# EAGLE design Side 1 v1 (EAGLE 8.5.0)
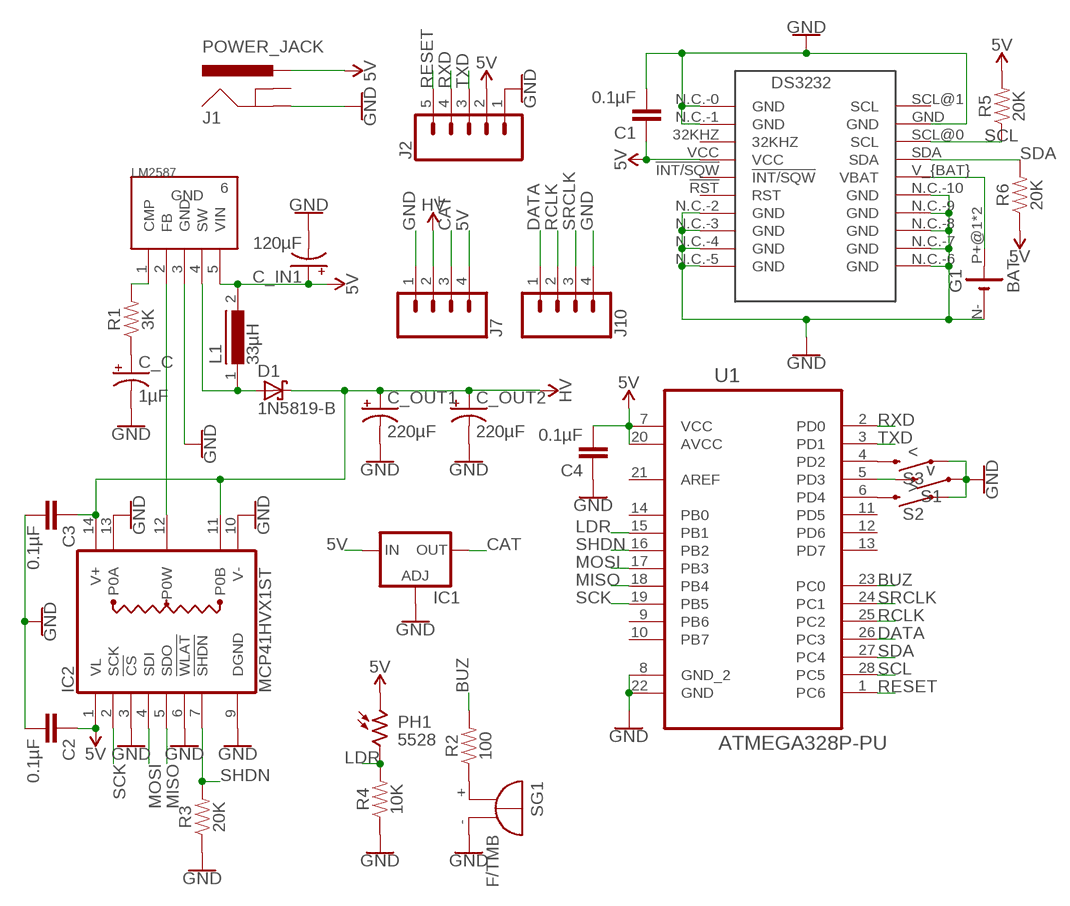
[diagram p0: schematic, sheet 1]

## Parts
C1  0.1µF  0.1µF-0.1''  [CAP-0.1I]
C2  0.1µF  0.1µF-0.1''  [CAP-0.1I]
C3  0.1µF  0.1µF-0.1''  [CAP-0.1I]
C4  0.1µF  0.1µF-0.1''  [CAP-0.1I]
C_C  1µF  CAP_POL_1µF  [CAP_POL_2MM]
C_IN1  120µF  CAP_POL_120µF  [CAP_POL_3MM]
C_OUT1  220µF  1000UF-RADIAL-5MM-25V-20%  [CPOL-RADIAL-5MM-10MM]
C_OUT2  220µF  1000UF-RADIAL-5MM-25V-20%  [CPOL-RADIAL-5MM-10MM]
D1  1N5819-B  [DO41-7.6]
G1  BAT  BATTERY-HOLDER_11.6MM  [CELL_RETAINER_11.6MM]
IC1  LM317TS  [317TS]
IC2  MCP41HVX1ST  [TSSOP14]
J1  POWER_JACK  [POWER_JACK_PTH]
J2  CONN_05  [1X05]
J7  CONN_04  [1X04]
J10  CONN_04  [1X04]
L1  33µH  MICC12  [MICC12]
LM2587  LM2587S  [TO263-5]
PH1  5528  [5528]
R1  3K  RESISTORAXIAL-0.3  [AXIAL-0.3]
R2  100  RESISTORAXIAL-0.3  [AXIAL-0.3]
R3  20K  RESISTORAXIAL-0.3  [AXIAL-0.3]
R4  10K  RESISTORAXIAL-0.3  [AXIAL-0.3]
R5  20K  RESISTORAXIAL-0.3  [AXIAL-0.3]
R6  20K  RESISTORAXIAL-0.3  [AXIAL-0.3]
S1  v  MOMENTARY-SWITCH-SPST-PTH-6.0MM  [TACTILE_SWITCH_PTH_6.0MM]
S2  >  MOMENTARY-SWITCH-SPST-PTH-6.0MM  [TACTILE_SWITCH_PTH_6.0MM]
S3  <  MOMENTARY-SWITCH-SPST-PTH-6.0MM  [TACTILE_SWITCH_PTH_6.0MM]
SG1  F/TMB  [F/TMB]
U1  ATMEGA328P-PU  [DIP254P762X457-28]
U$1  DS3232  [SO20-2]

## Nets
5V: C1.1 C2.1 C4.2 C_IN1.POS(+) IC1.3(IN) IC2.1(VL) J1.PWR J2.2 J7.4 L1.2 LM2587.5(VIN) PH1.1 R5.P$2 R6.P$1 U1.7(VCC) U1.20(AVCC) U$1.VCC
BAT: G1.P+@1(+) G1.P+@2(+) U$1.V_{BAT}(VBAT)
BUZ: R2.P$2 U1.23(PC0)
BUZR: R2.P$1 SG1.+
CAT: IC1.2(OUT) J7.3
DATA: J10.1 U1.26(PC3)
FB: IC2.12(P0W) LM2587.2(FB)
GND: C1.2 C2.2 C3.2 C4.1 C_C.NEG(-) C_IN1.NEG(-) C_OUT1.- C_OUT2.- G1.N-(-) IC1.1(ADJ) IC2.3(!CS) IC2.6(!WLAT) IC2.9(DGND) IC2.10(V-) IC2.13(P0A) J1.GND J2.1 J7.1 J10.4 LM2587.3(GND) R3.P$1 R4.P$1 S1.1 S2.1 S3.1 SG1.- U1.8(GND_2) U1.22(GND) U$1.GND U$1.N.C.-0(GND) U$1.N.C.-1(GND) U$1.N.C.-2(GND) U$1.N.C.-3(GND) U$1.N.C.-4(GND) U$1.N.C.-5(GND) U$1.N.C.-6(GND) U$1.N.C.-7(GND) U$1.N.C.-8(GND) U$1.N.C.-9(GND) U$1.N.C.-10(GND)
LBUT: S3.3 U1.4(PD2)
LDR: PH1.2 R4.P$2 U1.15(PB1)
MBUT: S1.3 U1.5(PD3)
MISO: IC2.5(SDO) U1.18(PB4)
MOSI: IC2.4(SDI) U1.17(PB3)
N$1: D1.A L1.1 LM2587.4(SW)
N$2: LM2587.1(CMP) R1.P$2
N$4: C_C.POS(+) R1.P$1
RBUT: S2.3 U1.6(PD4)
RCLK: J10.2 U1.25(PC2)
RESET: J2.5 U1.1(PC6)
RXD: J2.4 U1.2(PD0)
SCK: IC2.2(SCK) U1.19(PB5)
SCL: R5.P$1 U1.28(PC5) U$1.SCL@0(SCL)
SDA: R6.P$2 U1.27(PC4) U$1.SDA
SHDN: IC2.7(!SHDN) R3.P$2 U1.16(PB2)
SRCLK: J10.3 U1.24(PC1)
TXD: J2.3 U1.3(PD1)
VCC: C3.1 C_OUT1.+ C_OUT2.+ D1.C IC2.11(P0B) IC2.14(V+) J7.2 ; supply symbol labelled HV
Unconnected: J1.GNDBREAK LM2587.6(GND) U1.9(PB6) U1.10(PB7) U1.11(PD5) U1.12(PD6) U1.13(PD7) U1.14(PB0) U1.21(AREF) U$1.32KHZ U$1.!INT/SQW U$1.!RST(RST) U$1.SCL@1(SCL)

## Library data of the parts
C1-C4 = Clock components:0.1µF: 0.1uF/100nF/100,000pF ceramic capacitors A capacitor is a passive two-terminal electrical component used to store electrical energy temporarily in an electric field.
C_C = Clock components:CAP_POL_1µF
C_IN1 = Clock components:CAP_POL_120µF
C_OUT1 C_OUT2 = SparkFun-Capacitors:1000UF: 1,000µF/1mF ceramic capacitors A capacitor is a passive two-terminal electrical component used to store electrical energy temporarily in an electric field. CAP-08070; PROD_ID: CAP-09538; VALUE: 1mF
D1 = diode:1N581*: 1.0A SCHOTTKY BARRIER RECTIFIER Source: http://www.diodes.com/datasheets/ds23001.pdf
G1 = battery:BATTERY-HOLDER_11.6MM: 11.6mm PC BUTTON CELL RETAINER, high 5.97mm KEYSTONE ELECTRONICS CORP. Data sheet <http://www.farnell.com/cad/1718310.pdf>; MF: KEYSTONE; MPN: 2997; OC_FARNELL: 2293265
IC1 = v-reg:LM317TS: VOLTAGE REGULATOR
IC2 = microchip-mcp41hvx1:MCP41HVX1: The MCP45HVX1 family of devices have dual power rails (analog and digital). The analog power rail allows high voltage on the resistor network terminal pins. The analog voltage range is determined by the V+ and V– voltages. The library has been designed by Richard Magdycz <https://www.facebook.com/groups/eaglecadsoftUK>
J1 = SparkFun-Connectors:POWER_JACK: Power Jack Connector This is the standard 5.5mm barrel jack for power. The PTH is the most common, proven, reliable, footprint. The Slot footprint only works if the mill layer is transmitted to the PCB fab house so be warned. Here are the connectors we sell at SparkFun: DC Barrel Power Jack/Connector <https://www.sparkfun.com/products/119> (PRT-00119) DC Barrel Power Jack/Connector (SMD) <https://www.sparkfun.com/products/12748> (PRT-12748) DC Barrel Jack Adapter - Breadboard Compatible <https://www.sparkfun.com/products/10811> (PRT-10811) It is used on this SparkFun product (and many, many others): SparkFun RedBoard - Programmed with Arduino <https://www.sparkfun.com/products/12757> (DEV-12757) Also, if you need a mating power supply or connector, please check these out: Wall Adapter Power Supply - 9VDC 650mA <https://www.sparkfun.com/products/298> (TOL-00298) DC Barrel Jack Adapter - Male <https://www.sparkfun.com/products/10287> (PRT-10287); PROD_ID: CONN-08197
J2 = SparkFun-Connectors:CONN_05: Multi connection point. Often used as Generic Header-pin footprint for 0.1 inch spaced/style header connections On any of the 0.1 inch spaced packages, you can populate with these: Break Away Headers - Straight <https://www.sparkfun.com/products/116> (PRT-00116) Break Away Male Headers - Right Angle <https://www.sparkfun.com/products/553> (PRT-00553) Female Headers <https://www.sparkfun.com/products/115> (PRT-00115) Break Away Headers - Machine Pin <https://www.sparkfun.com/products/117> (PRT-00117) Break Away Female Headers - Swiss Machine Pin <https://www.sparkfun.com/products/743> (PRT-00743) For SCREWTERMINALS and SPRING TERMINALS visit here: Screw Terimnals on SparkFun.com <https://www.sparkfun.com/search/results?term=Screw+Terminals> (5mm/3.5mm/2.54mm spacing) This device is also useful as a general connection point to wire up your design to another part of your project. Our various solder wires solder well into these plated through hole pads. Hook-Up Wire - Assortment (Stranded, 22 AWG) <https://www.sparkfun.com/products/11375> (PRT-11375) Hook-Up Wire - Assortment (Solid Core, 22 AWG) <https://www.sparkfun.com/products/11367> (PRT-11367) View the entire wire category on our website here <https://www.sparkfun.com/categories/141> Special notes: Molex polarized connector foot print use with SKU : PRT-08231 with associated crimp pins and housings. 1MM SMD Version SKU: PRT-10208
J7 J10 = SparkFun-Connectors:CONN_04: Multi connection point. Often used as Generic Header-pin footprint for 0.1 inch spaced/style header connections On any of the 0.1 inch spaced packages, you can populate with these: Break Away Headers - Straight <https://www.sparkfun.com/products/116> (PRT-00116) Break Away Male Headers - Right Angle <https://www.sparkfun.com/products/553> (PRT-00553) Female Headers <https://www.sparkfun.com/products/115> (PRT-00115) Break Away Headers - Machine Pin <https://www.sparkfun.com/products/117> (PRT-00117) Break Away Female Headers - Swiss Machine Pin <https://www.sparkfun.com/products/743> (PRT-00743) For SCREWTERMINALS and SPRING TERMINALS visit here: Screw Terimnals on SparkFun.com <https://www.sparkfun.com/search/results?term=Screw+Terminals> (5mm/3.5mm/2.54mm spacing) This device is also useful as a general connection point to wire up your design to another part of your project. Our various solder wires solder well into these plated through hole pads. Hook-Up Wire - Assortment (Stranded, 22 AWG) <https://www.sparkfun.com/products/11375> (PRT-11375) Hook-Up Wire - Assortment (Solid Core, 22 AWG) <https://www.sparkfun.com/products/11367> (PRT-11367) View the entire wire category on our website here <https://www.sparkfun.com/categories/141> Special notes: Molex polarized connector foot print use with SKU : PRT-08231 with associated crimp pins and housings. 1MM SMD Version SKU: PRT-10208; PROD_ID: CONN-09696
L1 = inductors:MICC12: INDUCTOR; SPICEPREFIX: L
LM2587 = Clock components:LM2587S: LM2587 SIMPLE SWITCHER 5A Flyback Regulator
PH1 = Clock components:5528
R1-R6 = SparkFun-Resistors:RESISTOR: Generic Resistor Package
S1-S3 = SparkFun-Switches:MOMENTARY-SWITCH-SPST: Momentary Switch (Pushbutton) - SPST Normally-open (NO) SPST momentary switches (buttons, pushbuttons). Variants PTH-12MM - 12mm square, through-hole Momentary Pushbutton Switch - 12mm Square <https://www.sparkfun.com/products/9190> (COM-09190) PTH-6.0MM, PTH-6.0MM-KIT - 6.0mm square, through-hole Mini Pushbutton Switch <https://www.sparkfun.com/products/97> (COM-00097) KIT package intended for soldering kit's - only one side of pads' copper is exposed. PTH-RIGHT-ANGLE-KIT - Right-angle, through-hole Right Angle Tactile Button <https://www.sparkfun.com/products/10791> - Used on SparkFun BigTime Watch Kit <https://www.sparkfun.com/products/11734> SMD-12MM - 12mm square, surface-mount Tactile Button - SMD (12mm) <https://www.sparkfun.com/products/12993> (COM-12993) Used on SparkFun PicoBoard <https://www.sparkfun.com/products/11888> SMD-4.5MM - 4.5mm Square Trackball Switch Used on SparkFun Blackberry Trackballer Breakout <https://www.sparkfun.com/products/13169> SMD-4.6MMX2.8MM - 4.60mm x 2.80mm, surface mount Used on SparkFun SAMD21 Mini Breakout <https://www.sparkfun.com/products/13664> SMD-5.2MM, SMD-5.2-REDUNDANT - 5.2mm square, surface-mount Mini Pushbutton Switch - SMD <https://www.sparkfun.com/products/8720> (COM-08720) Used on Arduino Pro Mini <https://www.sparkfun.com/products/11114> REDUNDANT package connects both switch circuits together SMD-6.0X3.5MM - 6.0 x 3.5mm, surface mount Momentary Reset Switch SMD <https://www.sparkfun.com/products/8229> (COM-08229) SMD-6.2MM-TALL - 6.2mm square, surface mount Tactile Button - SMD (6mm) <https://www.sparkfun.com/products/12992> Used on SparkFun Digital Sandbox <https://www.sparkfun.com/products/12651> SMD-RIGHT-ANGLE - Right-angle, surface mount Used on SparkFun Block for Intel® Edison - Arduino <https://www.sparkfun.com/products/13036>; PROD_ID: SWCH-08441; SF_SKU: COM-00097
SG1 = buzzer:F/TMB: BUZZER Source: Buerklin; OC_FARNELL: unknown; OC_NEWARK: unknown
U1 = Atmel_By_element14_Batch_1-00:ATMEGA328P-PU: 8-bit Microcontroller with In-System Programmable Flash; MPN: ATMEGA328P-PU; OC_FARNELL: 1715487; OC_NEWARK: 15R0268; PACKAGE: PDIP-28; SUPPLIER: Atmel
U$1 = ds3232:DS3232: Maxims DS3232 is a high precision rtc

## Board
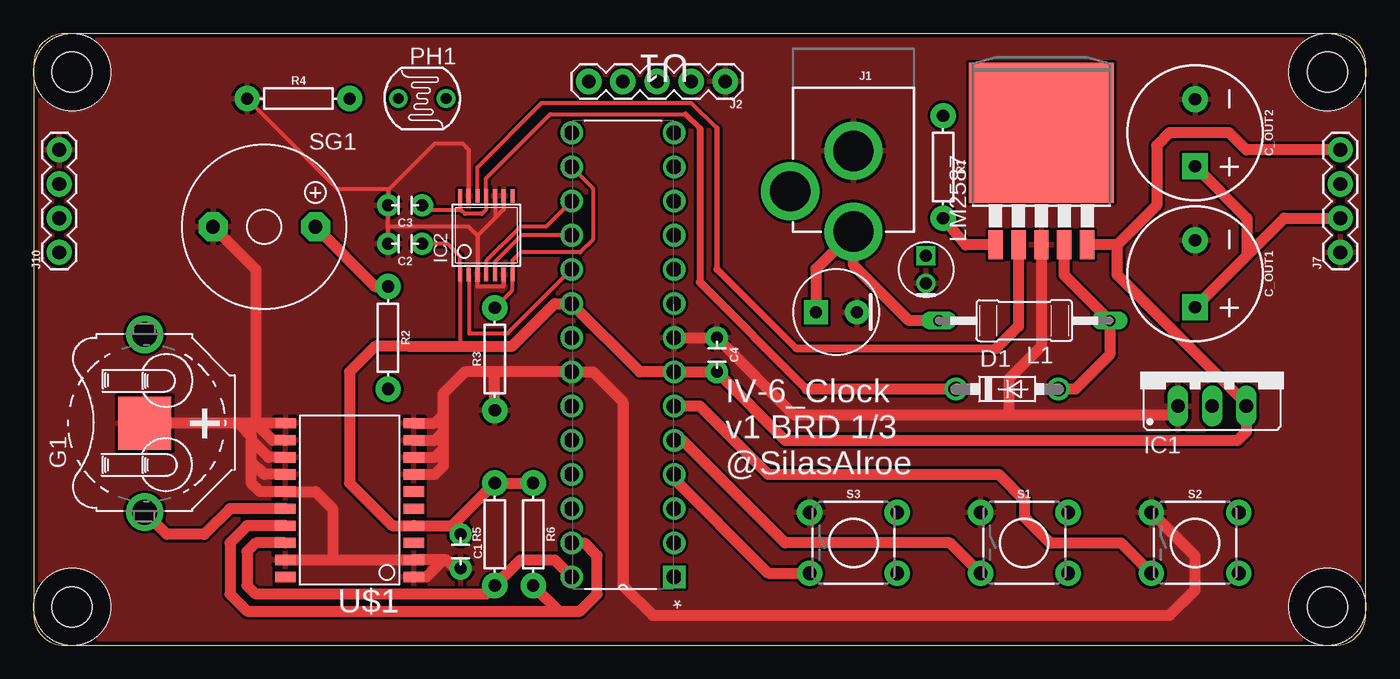
[diagram p1: board, top side]
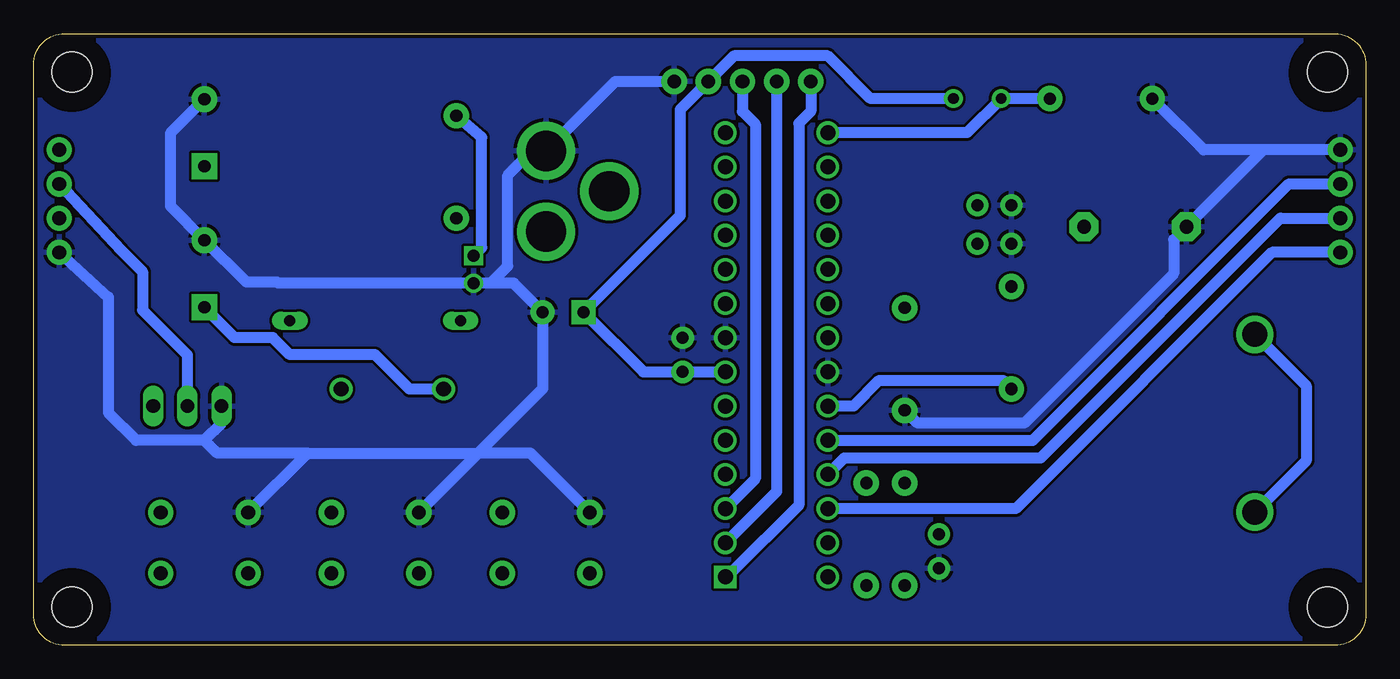
[diagram p2: board, bottom side, seen from below]

Size 99.06 x 45.47 mm. Coordinates in mm from the lower left corner, seen from the top.
Outline: 96.77,45.47 2.28,45.47 arc90 0,43.11 0,2.29 arc90 2.29,0 96.77,0 arc90 99.06,2.29 99.06,43.18 arc90 96.77,45.47
Copper layers (1*16): Top 0.035mm / dielectric 1.5mm / Bottom 0.035mm
Design rules "default *": minimum track width 12mil, minimum drill 0.35mm, track to track 8mil, track to pad 8mil, pad to pad 8mil, via to via 8mil, smd to smd 8mil, copper to edge 12mil, drill to drill 12mil, minimum pad ring 10mil, minimum via ring 8mil, stop-mask expansion 4mil, vias tented up to drill 0mil, thermal gap 10mil
Holes 3 mm at 2.86,2.86 2.86,42.61 96.2,42.61 96.2,2.86
tRestrict: area 1.2,1.2 to 4.5,4.5; area 1.2,40.9 to 4.5,44.2; area 94.6,40.9 to 97.8,44.2; area 94.6,1.2 to 97.8,4.5
bRestrict: area 1.2,1.2 to 4.5,4.5; area 1.2,40.9 to 4.5,44.2; area 94.6,40.9 to 97.8,44.2; area 94.6,1.2 to 97.8,4.5

### Footprints (pad centres in the part's own frame; a part is rotated, then mirrored left to right if it is on the bottom)
CAP-0.1I = drill 0.9 pad 1.651: 1 -1.27,0; 2 1.27,0
CAP_POL_2MM = drill 0.9: NEG 1.016,0 | drill 0.9 square: POS -1.016,0
CAP_POL_3MM = drill 0.9 pad 1.778: NEG 1.524,0 | drill 0.9 pad 1.778 square: POS -1.524,0
CPOL-RADIAL-5MM-10MM = drill 0.9 pad 1.93 square: + 2.5,0 | drill 0.9 pad 1.93: - -2.5,0
DO41-7.6 = drill 1.1 pad 1.7: A 3.81,0; C -3.81,0
CELL_RETAINER_11.6MM = smd 3.96 x 3.96: N- 0,0 | drill 1.85 pad 2.54: P+@1 -6.605,0; P+@2 6.605,0
317TS = drill 1.016 long: 1 -2.54,-2.54; 2 0,-2.54; 3 2.54,-2.54
TSSOP14 = smd 0.305 x 0.991: 1 -1.95,-2.918; 2 -1.3,-2.918; 3 -0.65,-2.918; 4 0,-2.918; 5 0.65,-2.918; 6 1.3,-2.918; 7 1.95,-2.918; 8 1.95,2.918; 9 1.3,2.918; 10 0.65,2.918; 11 0,2.918; 12 -0.65,2.918; 13 -1.3,2.918; 14 -1.95,2.918
POWER_JACK_PTH = drill 2.997 pad 4.318: GND 0,7.7; GNDBREAK 4.7,10.7; PWR 0,13.7
1X05 = drill 1.016 pad 1.88: 1 0,0; 2 2.54,0; 3 5.08,0; 4 7.62,0; 5 10.16,0
1X04 = drill 1.016 pad 1.88: 1 0,0; 2 2.54,0; 3 5.08,0; 4 7.62,0
MICC12 = drill 0.813 long: 1 -6.35,0; 2 6.35,0
TO263-5 = smd 1.067 x 2.159: 1 -3.404,-5.791; 2 -1.702,-5.791; 3 0,-5.791; 4 1.702,-5.791; 5 3.404,-5.791 | smd 10.8 x 10.41: 6 0,2.54
5528 = drill 0.8 pad 1.4: 1 -1.778,0; 2 1.778,0
AXIAL-0.3 = drill 0.9 pad 1.88: P$1 -3.81,0; P$2 3.81,0
TACTILE_SWITCH_PTH_6.0MM = drill 1.016 pad 1.88: 1 -3.251,2.261; 2 3.251,2.261; 3 -3.251,-2.261; 4 3.251,-2.261
F/TMB = drill 1.016 pad 2.159 octagon: + 3.81,0; - -3.81,0
DIP254P762X457-28 = drill 1.118 square: 1 -7.62,33.02 | drill 1.118: 2 -7.62,30.48; 3 -7.62,27.94; 4 -7.62,25.4; 5 -7.62,22.86; 6 -7.62,20.32; 7 -7.62,17.78; 8 -7.62,15.24; 9 -7.62,12.7; 10 -7.62,10.16; 11 -7.62,7.62; 12 -7.62,5.08; 13 -7.62,2.54; 14 -7.62,0; 15 0,0; 16 0,2.54; 17 0,5.08; 18 0,7.62; 19 0,10.16; 20 0,12.7; 21 0,15.24; 22 0,17.78; 23 0,20.32; 24 0,22.86; 25 0,25.4; 26 0,27.94; 27 0,30.48; 28 0,33.02
SO20-2 = smd 0.762 x 1.524: 32KHZ -3.175,-4.775; !INT/SQW -0.635,-4.775; !RST 0.635,-4.775; GND 0.635,4.775; N.C.-0 -5.715,-4.775; N.C.-1 -4.445,-4.775; N.C.-2 1.905,-4.775; N.C.-3 3.175,-4.775; N.C.-4 4.445,-4.775; N.C.-5 5.715,-4.775; N.C.-6 5.715,4.75; N.C.-7 4.445,4.775; N.C.-8 3.175,4.775; N.C.-9 1.905,4.775; N.C.-10 -4.445,4.775; SCL@0 -3.175,4.775; SCL@1 -5.715,4.775; SDA -1.905,4.775; V_{BAT} -0.635,4.775; VCC -1.905,-4.775

### Placement (x,y rotation side)
C1  31.75,6.99 270 top
C2  27.62,29.84 180 top
C3  27.62,32.7 180 top
C4  50.8,21.59 270 top
C_C  66.36,27.94 270 top
C_IN1  59.69,24.77 0 top
C_OUT1  86.36,27.62 270 top
C_OUT2  86.36,38.1 270 top
D1  72.39,19.05 0 top
G1  8.26,16.51 90 top
IC1  87.63,20.32 0 top
IC2  33.66,30.48 0 top
J1  60.96,44.45 180 top
J2  51.44,41.91 180 top
J7  97.16,29.21 90 top
J10  1.91,29.21 90 top
L1  73.66,24.13 180 top
LM2587  74.93,35.56 0 top
PH1  28.89,40.64 180 top
R1  67.63,35.56 270 top
R2  26.35,22.86 270 top
R3  34.29,21.27 90 top
R4  19.68,40.64 0 top
R5  34.29,8.26 90 top
R6  37.15,8.26 270 top
S1  73.66,7.62 0 top
S2  86.36,7.62 0 top
S3  60.96,7.62 0 top
SG1  17.14,31.11 0 top
U1  40.01,38.1 180 top
U$1  23.5,10.79 90 top

### Tracks (layer width: path | path; a pad name or v marks a point on that pad's centre or on a via)
5V
  Top 0.305: 27.89,22.27 27.94,22.23 | 31.75,22.23 31.7,22.27 IC2.1 31.7,28.94 30.8,29.84 C2.1
  Top 0.813: J7.4 90.17,36.83 88.9,38.1 84.45,38.1 83.5,37.15 83.5,32.7 80.57,29.77 | 80.57,29.77 LM2587.5 | C_IN1.POS 58.17,27.96 J1.PWR 60.96,28.26 65.09,24.13 L1.2 | 80.57,29.77 80.57,27.54 90.17,17.94 IC1.3 90.17,15.88 89.53,15.24 55.88,15.24 C4.2 U1.7 45.09,20.32 U1.20 38.73,25.4 35.56,22.23 31.75,22.23 27.94,22.23 25.4,22.23 23.5,20.32 23.5,12.06 26.67,8.89 U$1.VCC 31.11,8.89 | R6.P$1 R5.P$2 31.11,8.89 | C1.1 31.11,8.89
  Bottom 0.813: U1.7 53.72,20.32 C_IN1.POS 50.99,31.94 50.99,39.81 J2.2 46.99,43.81 40.01,43.81 36.83,40.64 PH1.1
BAT
  Top 0.813: U$1.V_{BAT} 14.61,10.16 12.7,8.26 9.9,8.26 G1.P+@1
  Bottom 0.813: G1.P+@2 4.45,19.3 4.45,13.71 G1.P+@1
BUZ
  Bottom 0.813: U1.23 38.1,17.78 36.2,19.68 26.99,19.68 R2.P$2
BUZR
  Top 0.813: R2.P$1 25.4,26.67 SG1.+
CAT
  Bottom 0.813: IC1.2 87.63,21.59 90.96,24.92 90.96,27.78 92.55,29.37 J7.3
DATA
  Bottom 0.813: J10.1 6.99,29.21 26.04,10.16 U1.26
FB
  Top 0.305: 50.8,38.42 48.9,40.32 37.78,40.32 33.01,35.55 IC2.12
  Top 0.406: 50.8,38.42 50.8,27.94
  Top 0.508: 50.8,27.94 56.67,22.07 56.83,22.07
  Top 0.61: 56.83,22.07 71.6,22.07
  Top 0.813: LM2587.2 73.23,23.7 71.6,22.07
GND
  Top 0.305: IC2.10 34.3,31.75 | IC2.9 34.95,32.4 34.3,31.75 | IC2.6 34.95,26.7 34.92,26.67 33.02,26.67 33.01,26.68 IC2.3 33.01,30.45 | IC2.13 32.35,36.83 31.88,37.31 29.84,37.31 26.43,33.89 | 26.43,33.89 26.35,33.81 C3.2 26.35,31.11 | C2.2 26.35,31.11 | 26.43,33.89 22.62,33.89 R4.P$1 | 34.3,31.75 33.01,30.45 | 33.01,30.45 32.34,31.11 26.35,31.11
  Top 0.813: LM2587.3 74.93,22.23 72.52,19.81 72.52,17.34 72.71,17.14 | U$1.N.C.-6 16.51,16.51 | 16.19,16.51 15.24,16.51 | 15.24,16.51 G1.N- | U$1.N.C.-10 22.23,6.35 | 22.23,6.35 U$1.N.C.-1 30.48,6.35 | 34.29,20.32 U1.22 41.59,20.32 43.81,18.1 43.81,4.45 46.04,2.22 84.45,2.22 86.36,4.13 86.36,6.63 S2.1 | 34.29,20.32 32.08,20.32 30.48,18.72 30.48,17.14 | U$1.N.C.-2 29.84,12.7 30.48,13.34 30.48,14.61 | U$1.GND 20.95,11.43 22.23,10.16 22.23,6.35 | U$1.N.C.-7 17.78,15.24 16.51,16.51 | U$1.GND 17.78,11.43 | 30.48,14.61 30.48,15.88 | 30.48,15.88 30.48,17.14 | U$1.N.C.-4 29.84,15.24 30.48,15.88 | U$1.N.C.-3 29.84,13.97 30.48,14.61 | U$1.N.C.-5 29.84,16.51 30.48,17.14 | U$1.GND 16.83,11.43 16.19,12.06 16.19,13.65 | 16.19,13.65 16.19,15.24 | 16.19,15.56 16.19,16.51 | 16.51,16.51 16.19,16.51 | 16.19,15.24 17.46,13.97 U$1.N.C.-8 | 16.19,13.65 17.14,12.7 U$1.N.C.-9 | 15.24,16.51 16.19,15.56 | 16.19,15.56 16.19,15.24 | R3.P$1 34.29,20.32 | 30.48,6.35 30.72,6.35 31.35,5.71 C1.2 | U$1.N.C.-0 29.21,5.08 30.48,6.35 | U1.8 50.78,22.86 50.79,22.85 | SG1.- 16.51,27.94 16.51,16.51 | C4.1 56.52,17.14 72.71,17.14 | IC1.1 84.45,17.14 72.71,17.14
  Bottom 0.813: IC1.1 85.09,16.51 86.36,15.24 | 86.36,15.24 91.44,15.24 93.5,17.3 93.5,25.88 J7.1 | C_OUT2.- 88.9,38.06 88.9,32.66 C_OUT1.- | 86.36,30.48 C_OUT1.- | C_C.NEG 66.12,26.92 | 65.09,26.92 63.37,26.92 C_IN1.NEG 61.21,19.07 66,14.29 | 65.09,26.92 C_C.NEG | S1.1 66,14.29 | S2.1 78.7,14.29 | 78.7,14.29 66,14.29 | 78.7,14.29 85.41,14.29 86.36,15.24 | C_C.NEG 80.9,26.92 80.96,26.99 83.22,26.99 C_OUT1.- | J2.1 55.8,41.91 J1.GND 61.99,36.75 63.82,34.92 63.82,28.19 65.09,26.92 | S3.1 62.12,14.29 66,14.29 | J10.4 7.62,36.83 | 7.62,36.83 12.06,36.83 R4.P$1 | 7.62,36.83 SG1.- 14.29,30.16 14.29,27.62 25.4,16.51 33.34,16.51 R3.P$1
  pour Bottom: 0,0 0,45.4 98.11,45.4 99.06,44.45 99.06,0
  pour Top: 0,0 0,44.45 0.95,45.4 99.06,45.4 99.06,0
LBUT
  Top 0.813: S3.3 54.61,5.36 47.27,12.7 U1.4
LDR
  Bottom 0.813: U1.15 29.65,38.1 PH1.2 R4.P$2
MBUT
  Top 0.813: S1.3 68.15,7.62 55.88,7.62 48.26,15.24 U1.5
MISO
  Top 0.305: U1.18 36.28,30.48 34.3,28.51 IC2.5
MOSI
  Top 0.305: IC2.4 33.66,28.57 36.2,31.11 38.1,31.11 U1.17
N$1
  Top 0.813: LM2587.4 76.63,27.51 L1.1 80.01,21.59 77.47,19.05 D1.A
N$2
  Top 0.813: LM2587.1 69.29,29.77 R1.P$2
N$4
  Bottom 0.813: R1.P$1 65.75,37.76 65.75,29.57 C_C.POS
RBUT
  Top 0.813: S2.3 80.85,7.62 75.56,7.62 73.66,9.53 73.66,10.79 71.75,12.7 54.61,12.7 49.53,17.78 U1.6
RCLK
  Bottom 0.813: J10.2 6.35,31.75 24.17,13.93 38.77,13.93 U1.25
RESET
  Bottom 0.813: U1.1 47.2,5.38 42.16,10.41 42.16,38.8 41.27,39.69 J2.5
RXD
  Bottom 0.813: J2.4 43.81,11.43 U1.2
SCK
  Top 0.305: IC2.2 32.38,27.53 32.38,23.18 35.24,23.18 U1.19
SCL
  Top 0.813: U$1.SCL@0 16.51,7.62 15.88,6.99 15.88,4.45 16.51,3.81 33.66,3.81 R5.P$1 36.2,6.35 38.73,6.35 U1.28
SDA
  Top 0.813: U$1.SDA 15.88,8.89 14.61,7.62 14.61,3.81 15.88,2.54 39.05,2.54 | 39.05,2.54 40.64,2.54 41.91,3.81 41.91,6.67 40.96,7.62 U1.27 | R6.P$2 39.05,2.54
SHDN
  Top 0.305: U1.16 41.59,33.97 41.59,30.16 40.64,29.21 36.2,29.21 35.6,28.62 IC2.7 35.6,26.4 R3.P$2
SRCLK
  Bottom 0.813: J10.3 5.71,34.29 24.77,15.24 U1.24
TXD
  Bottom 0.813: J2.3 46.35,39.69 45.4,38.73 45.4,12.38 U1.3
VCC
  Top 0.305: IC2.14 31.7,32.43 31.75,32.38 | 31.75,32.38 32.07,32.07 33.34,32.07 33.66,32.38 IC2.11 33.66,34.73 38.42,39.49 48.46,39.49 | C3.1 29.21,32.38 31.75,32.38
  Top 0.406: 48.46,39.49 49.53,38.42
  Top 0.508: 49.53,38.42 49.53,26.99
  Top 0.61: 49.53,26.99 57.47,19.05
  Top 0.813: 86.36,25.72 C_OUT1.+ 90.21,28.97 | 90.21,28.97 92.99,31.75 J7.2 | C_OUT2.+ 90.21,31.75 90.21,28.97 | D1.C 57.47,19.05
  Bottom 0.813: D1.C 71.12,19.05 73.68,21.61 80.01,21.61 81.28,22.88 84.12,22.88 C_OUT1.+

### Text on the board
tNames: IV-6_Clock / v1 BRD 1/3 / @SilasAlroe